# EasyEDA Pro project ProPrj_DIR转接终版_2025-11-05.epro

# Schematic Schematic1
Board Name: Board1; Create Date: 2025-07-27; Page Name: P1; Project Name: DIR转接终版; Schematic Name: Schematic1; Update Date: 2025-09-10; Company: 嘉立创EDA; Page Size: A4; Version: V1.0
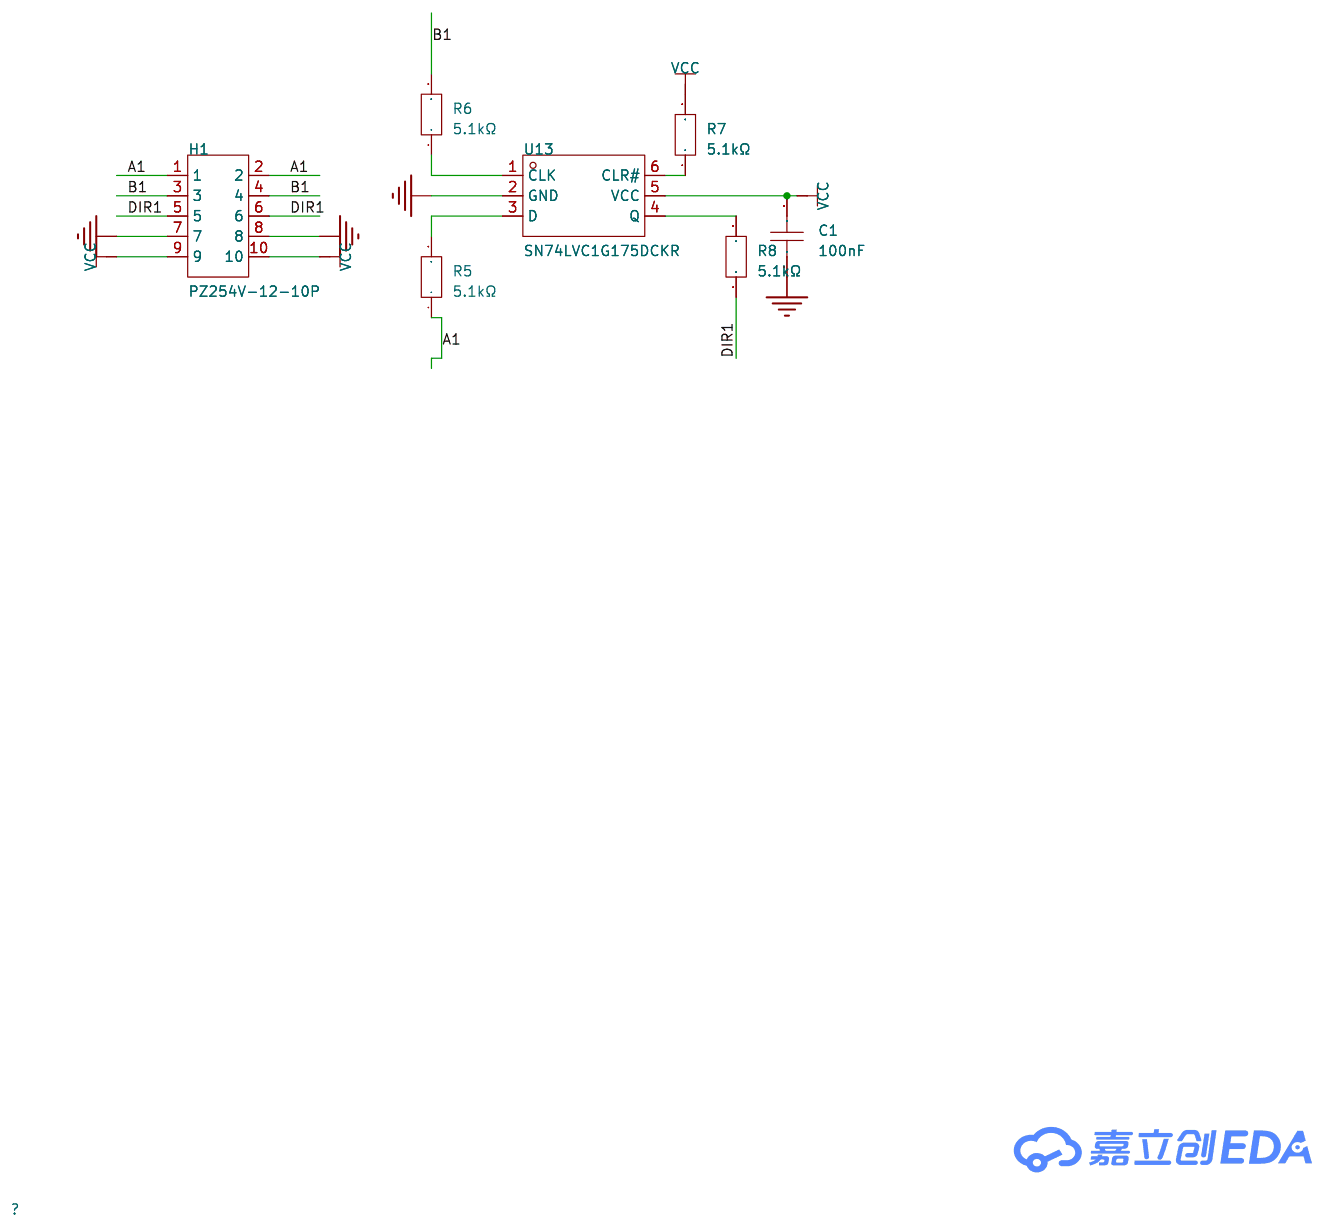
[diagram p0: schematic sheet]

## Parts
C1  100nF  [C0603]
H1  PZ254V-12-10P  [HDR-TH_10P-P2.54-V-M-R2-C5-S2.54]
R5  5.1kΩ  [R0603]
R6  5.1kΩ  [R0603]
R7  5.1kΩ  [R0603]
R8  5.1kΩ  [R0603]
U13  SN74LVC1G175DCKR  [SC-70-6_L2.0-W1.3-P0.65-LS2.1-BR]

## Library data of the parts
C1 = CC0603KRX7R9BB104: 容值:100nF;精度:±10%;额定电压:50V;温度系数:X7R;; LCSC Part Name: 100nF ±10% 50V; Supplier Part: C14663; Manufacturer: YAGEO(国巨); Supplier Footprint: 0603; JLCPCB Part Class: 基础库; Datasheet: https://atta.szlcsc.com/upload/public/pdf/source/20250214/096C4C206003071F5D32E5F0D8E7F8DF.pdf; Supplier: LCSC; Tolerance: ±10%; Voltage Rating: 50V; Temperature Coefficient: X7R
H1 = PZ254V-12-10P: 插针结构:2x5P;间距:2.54mm;行距:2.54mm;圆针/方针:方针;安装方式:直插;排数:双排;总PIN位数:10P;额定电流:-;额定电压:-;配合针长度:6mm;塑高:2.5mm;端接针长度:3mm;触头材质:黄铜;触头镀层:-;工作温度:-40℃~+105℃;颜色:黑色;; LCSC Part Name: 2x5P 间距:2.54mm 方针 直插; Supplier Part: C492422; Manufacturer: XFCN(兴飞); Supplier Footprint: 插件,P=2.54mm; JLCPCB Part Class: 扩展库; Datasheet: https://atta.szlcsc.com/upload/public/pdf/source/20200309/C492422_5020CEA01BE7051F9EA9DD81AB0A25E3.pdf; Supplier: LCSC; Pin Structure: 2x5P; Pitch: 2.54mm; Row Spacing: 2.54mm; Circluar Pins/Square Pins: 方针; Mounting Type: 直插; Number of Rows: 双排; Number of Pins: 10P; Length of Mating Pin: 6mm; Insulation Height: 2.5mm; Length of End Connection Pin: 3mm; Contact Material: 黄铜; Operating Temperature: -40℃~+105℃; Color: 黑色
R5-R8 = FRC0603F5101TS: 电阻类型:厚膜电阻;阻值:5.1kΩ;精度:±1%;功率:100mW;最大工作电压:75V;温度系数:±100ppm/℃;; LCSC Part Name: 5.1kΩ ±1% 100mW 厚膜电阻; Supplier Part: C2907044; Manufacturer: FOJAN(富捷); Supplier Footprint: 0603; JLCPCB Part Class: 扩展库; Datasheet: https://atta.szlcsc.com/upload/public/pdf/source/20211221/925EC7D7225764EE0046F22065062C87.pdf; Supplier: LCSC; Type: 厚膜电阻; Tolerance: ±1%; Power(Watts): 100mW; Overload Voltage (Max): 75V; Temperature Coefficient: ±100ppm/℃; Operating Temperature Range: -55℃~+155℃
U13 = SN74LVC1G175DCKR: 类型:D-型;工作电压:1.65V~5.5V;时钟频率(fc):175MHz;元件数:1;每个元件位数:1;传播延迟(tpd):5ns@5V,50pF;静态电流(Iq):10uA;; LCSC Part Name: 单路D型触发器与异步清除; Supplier Part: C202238; Manufacturer: TI(德州仪器); Supplier Footprint: SOT-363-6; JLCPCB Part Class: 扩展库; Datasheet: https://www.ti.com/cn/lit/gpn/sn74lvc1g175; Supplier: LCSC; Type: D-型; Trigger Type: 上升沿; Voltage - Supply: 1.65V~5.5V; Clock Frequency: 175MHz; Function: 复位; Number of Elements: 1; Number of Bits per Element: 1; Propagation Delay: 5ns@5V,50pF; Series: 74LVC系列; Current - Output Low(IOL): 32mA; Current - Output High(IOH): 32mA; Quiescent Current: 10uA; Input Capacitance: 3pF; Operating Temperature: -40℃~+125℃

## Nets
GND: C1.1 H1.7 H1.8 U13.2(GND)
VCC: C1.2 H1.9 H1.10 R7.2 U13.5(VCC)
A1: H1.1 H1.2 R5.1
B1: H1.3 H1.4 R6.2
DIR1: H1.5 H1.6 R8.1
$1N145: R6.1 U13.1(CLK)
$1N148: R5.2 U13.3(D)
$1N151: R8.2 U13.4(Q)
$1N382: R7.1 U13.6(CLR#)

# Board PCB1
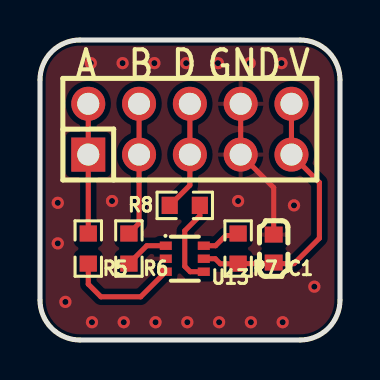
[diagram p1: board, top side]
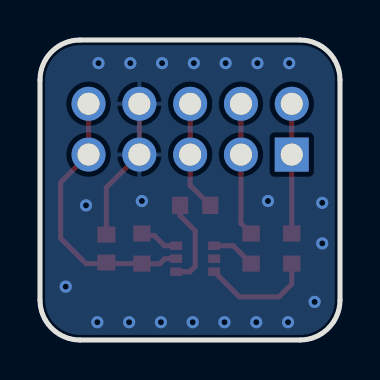
[diagram p2: board, bottom side, seen from below]

Outline 15 x 15 mm; copper layers: Top Layer, Bottom Layer. Coordinates in mm from the lower left corner of the outline.
Outline path: 0,13 0,2 arc(0.59,0.59) 2,0 13,0 arc(14.41,0.59) 15,2 15,13 arc(14.41,14.41) 13,15 2,15 arc(0.59,14.41) 0,13
Stack: Top Layer 0.035mm / Dielectric1 1.51mm FR4 er 4.5 / Bottom Layer 0.035mm

## Design rules (mm)
template: JLCPCB Capability(Two Layers Board)
spacing copperThickness1oz (default): track to track 0.102, other pairs 0.152 to 0.3
spacing copperThickness2oz: track to track 0.203, other pairs 0.152 to 0.3
track width copperThickness1oz (default): min 0.127, default 0.254, max 2.54
track width copperThickness2oz: min 0.203, default 0.254, max 2.54
differential pair differentialPair (default): width min 0.127, default 0.254, max 2.54; gap min 0.152, default 0.152
via viaSize (default): diameter min 0.5, default 0.61, max 10; hole min 0.3, default 0.305, max 6.3

## Placement (name value [footprint] x y rotation side)
C1  100nF  [C0603]  11.68 4.57 270 top
H1  PZ254V-12-10P  [HDR-TH_10P-P2.54-V-M-R2-C5-S2.54]  7.49 10.54 0 top
R5  5.1kΩ  [R0603]  2.41 4.57 270 top
R6  5.1kΩ  [R0603]  4.44 4.57 90 top
R7  5.1kΩ  [R0603]  9.91 4.57 270 top
R8  5.1kΩ  [R0603]  7.24 6.73 0 top
U13  SN74LVC1G175DCKR  [SC-70-6_L2.0-W1.3-P0.65-LS2.1-BR]  7.24 4.06 180 top

## Footprints (pads in the part's own frame, mm; a bottom-side part is the same pattern mirrored in y, then rotated)
C0603
  rect 0.8x0.9 smd: 1(-0.7,0) 2(0.7,0)
HDR-TH_10P-P2.54-V-M-R2-C5-S2.54
  rect 1.7x1.7 hole 1.1: 1(-5.08,-1.27)
  round 1.7 hole 1.1: 2(-5.08,1.27) 3(-2.54,-1.27) 4(-2.54,1.27) 5(0,-1.27) 6(0,1.27) 7(2.54,-1.27) 8(2.54,1.27) 9(5.08,-1.27) 10(5.08,1.27)
R0603
  rect 0.806x0.864 smd: 1(-0.753,0) 2(0.753,0)
SC-70-6_L2.0-W1.3-P0.65-LS2.1-BR
  rect 0.6x0.42 smd: 1(0.95,-0.65) 2(0.95,0) 3(0.95,0.65) 4(-0.95,0.65) 5(-0.95,0) 6(-0.95,-0.65)

## Nets
As in the schematic.

## Via types
v1: diameter 0.61, hole 0.305, Top Layer to Bottom Layer, 21 vias

## Routing (per net, layer and track width the routed paths; a pad name or vN(x,y) marks a point on that pad's centre or on a via; arc(x,y) is an arc through that point)
GND: length 7.2
  Top Layer w0.254: H1.8 H1.7 11.68,7.62 11.68,5.33
  vias: v1(0.89,6.86) v1(0.89,4.83) v1(1.27,1.91) v1(2.54,13.84) v1(2.6,0.89) v1(3.6,6.95) v1(4.13,13.84) v1(4.19,0.89) v1(5.72,13.84) v1(5.78,0.89) v1(7.31,13.84) v1(7.37,0.89) v1(8.9,13.84) v1(8.95,0.89) v1(9.91,6.95) v1(10.49,13.84) v1(10.54,0.89) v1(12.07,13.84) v1(12.13,0.89) v1(12.7,6.73) v1(13.72,2.67)
VCC: length 13.7
  Top Layer w0.254: U13.5 8.76,4.06 9.02,3.81 9.9,3.81 R7.2 12.7,3.82 13.97,5.09 13.97,7.87 H1.9 H1.10
A1: length 5.6
  Top Layer w0.254: H1.1 H1.2 ; R5.1 2.41,8.38
B1: length 6.7
  Top Layer w0.254: H1.4 H1.3 4.95,5.83 R6.2
DIR1: length 5.5
  Top Layer w0.254: H1.6 H1.5 7.49,7.74 R8.1
$1N145: length 2.2
  Top Layer w0.254: R6.1 5.34,4.71 U13.1
$1N148: length 5.7
  Top Layer w0.254: U13.3 5.03,2.16 3.05,2.16 2.41,2.79 R5.2
$1N151: length 4.4
  Top Layer w0.254: R8.2 7.99,6.21 7.24,5.46 7.24,3.68 7.51,3.41 U13.4
$1N382: length 2
  Top Layer w0.254: R7.1 9.8,5.22 9.29,5.22 8.78,4.71 U13.6

## Copper pours and planes (outline as drawn; the poured copper is in the pictures)
GND on Top Layer: -3.56,16 19.3,16 19.3,-2.41 -3.56,-2.41
GND on Bottom Layer: -2.41,17.27 16.26,17.27 16.26,-3.18 -2.41,-3.18

## Text on the board
Top Silkscreen Layer: A | B | D | GND | V
